# EAGLE design Selectric (EAGLE 7.7.0)

## Sheet 1 of 3
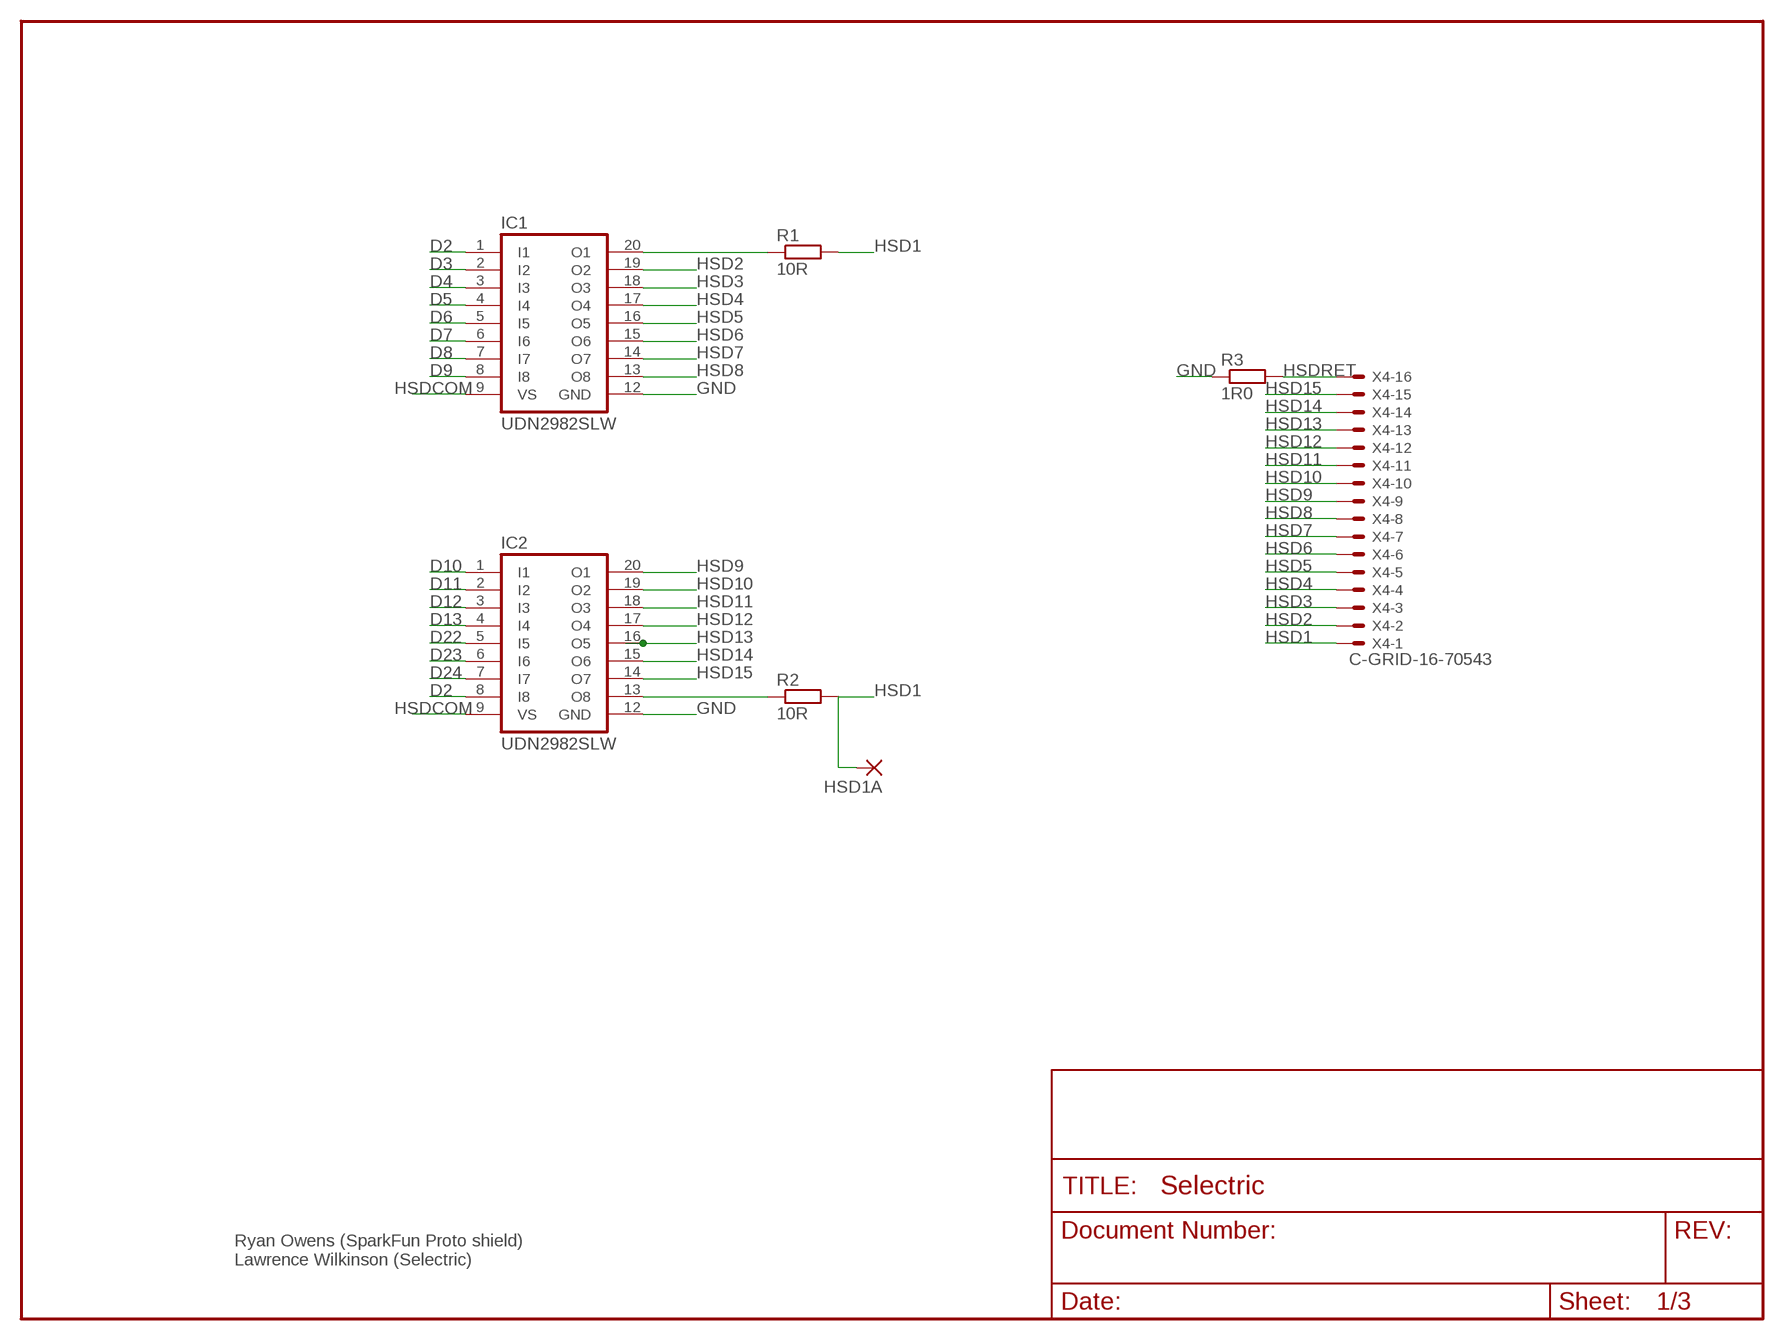
[diagram p0: schematic, sheet 1]

### Parts
HSD1A  2,15/1,0  [2,15/1,0]
IC1  UDN2982SLW  [SO20W]
IC2  UDN2982SLW  [SO20W]
R1  10R  R-EU_M1206  [M1206]
R2  10R  R-EU_M1206  [M1206]
R3  1R0  R-EU_0922/22  [0922/22]
X4  C-GRID-16-70543  [70543-16]

### Nets
D2: IC1.1(I1) IC2.8(I8) ; also sheet 3
D3: IC1.2(I2) ; also sheet 3
D4: IC1.3(I3) ; also sheet 3
D5: IC1.4(I4) ; also sheet 3
D6: IC1.5(I5) ; also sheet 3
D7: IC1.6(I6) ; also sheet 3
D8: IC1.7(I7) ; also sheet 3
D9: IC1.8(I8) ; also sheet 3
D10: IC2.1(I1) ; also sheet 3
D11: IC2.2(I2) ; also sheet 3
D12: IC2.3(I3) ; also sheet 3
D13: IC2.4(I4) ; also sheet 3
D22: IC2.5(I5) ; also sheet 2
D23: IC2.6(I6) ; also sheet 2
D24: IC2.7(I7) ; also sheet 2
GND [supplyIn]: IC1.12(GND) IC2.12(GND) R3.1 ; also sheet 2,3
HSD1 [hsd]: HSD1A.1(P) R1.2 R2.2 X4.1
HSD1A [hsd]: IC2.13(O8) R2.1
HSD2 [hsd]: IC1.19(O2) X4.2
HSD3 [hsd]: IC1.18(O3) X4.3
HSD4 [hsd]: IC1.17(O4) X4.4
HSD5 [hsd]: IC1.16(O5) X4.5
HSD6 [hsd]: IC1.15(O6) X4.6
HSD7 [hsd]: IC1.14(O7) X4.7
HSD8 [hsd]: IC1.13(O8) X4.8
HSD9 [hsd]: IC2.20(O1) X4.9
HSD10 [hsd]: IC2.19(O2) X4.10
HSD11 [hsd]: IC2.18(O3) X4.11
HSD12 [hsd]: IC2.17(O4) X4.12
HSD13 [hsd]: IC2.16(O5) X4.13
HSD14 [hsd]: IC2.15(O6) X4.14
HSD15 [hsd]: IC2.14(O7) X4.15
HSDCOM [supplyIn]: IC1.9(VS) IC2.9(VS) ; also sheet 3
HSDRET [supplyIn]: R3.2 X4.16 ; also sheet 3
N$8 [hsd]: IC1.20(O1) R1.1

### Notes on the sheet
- Ryan Owens (SparkFun Proto shield)
  Lawrence Wilkinson (Selectric)

## Sheet 2 of 3
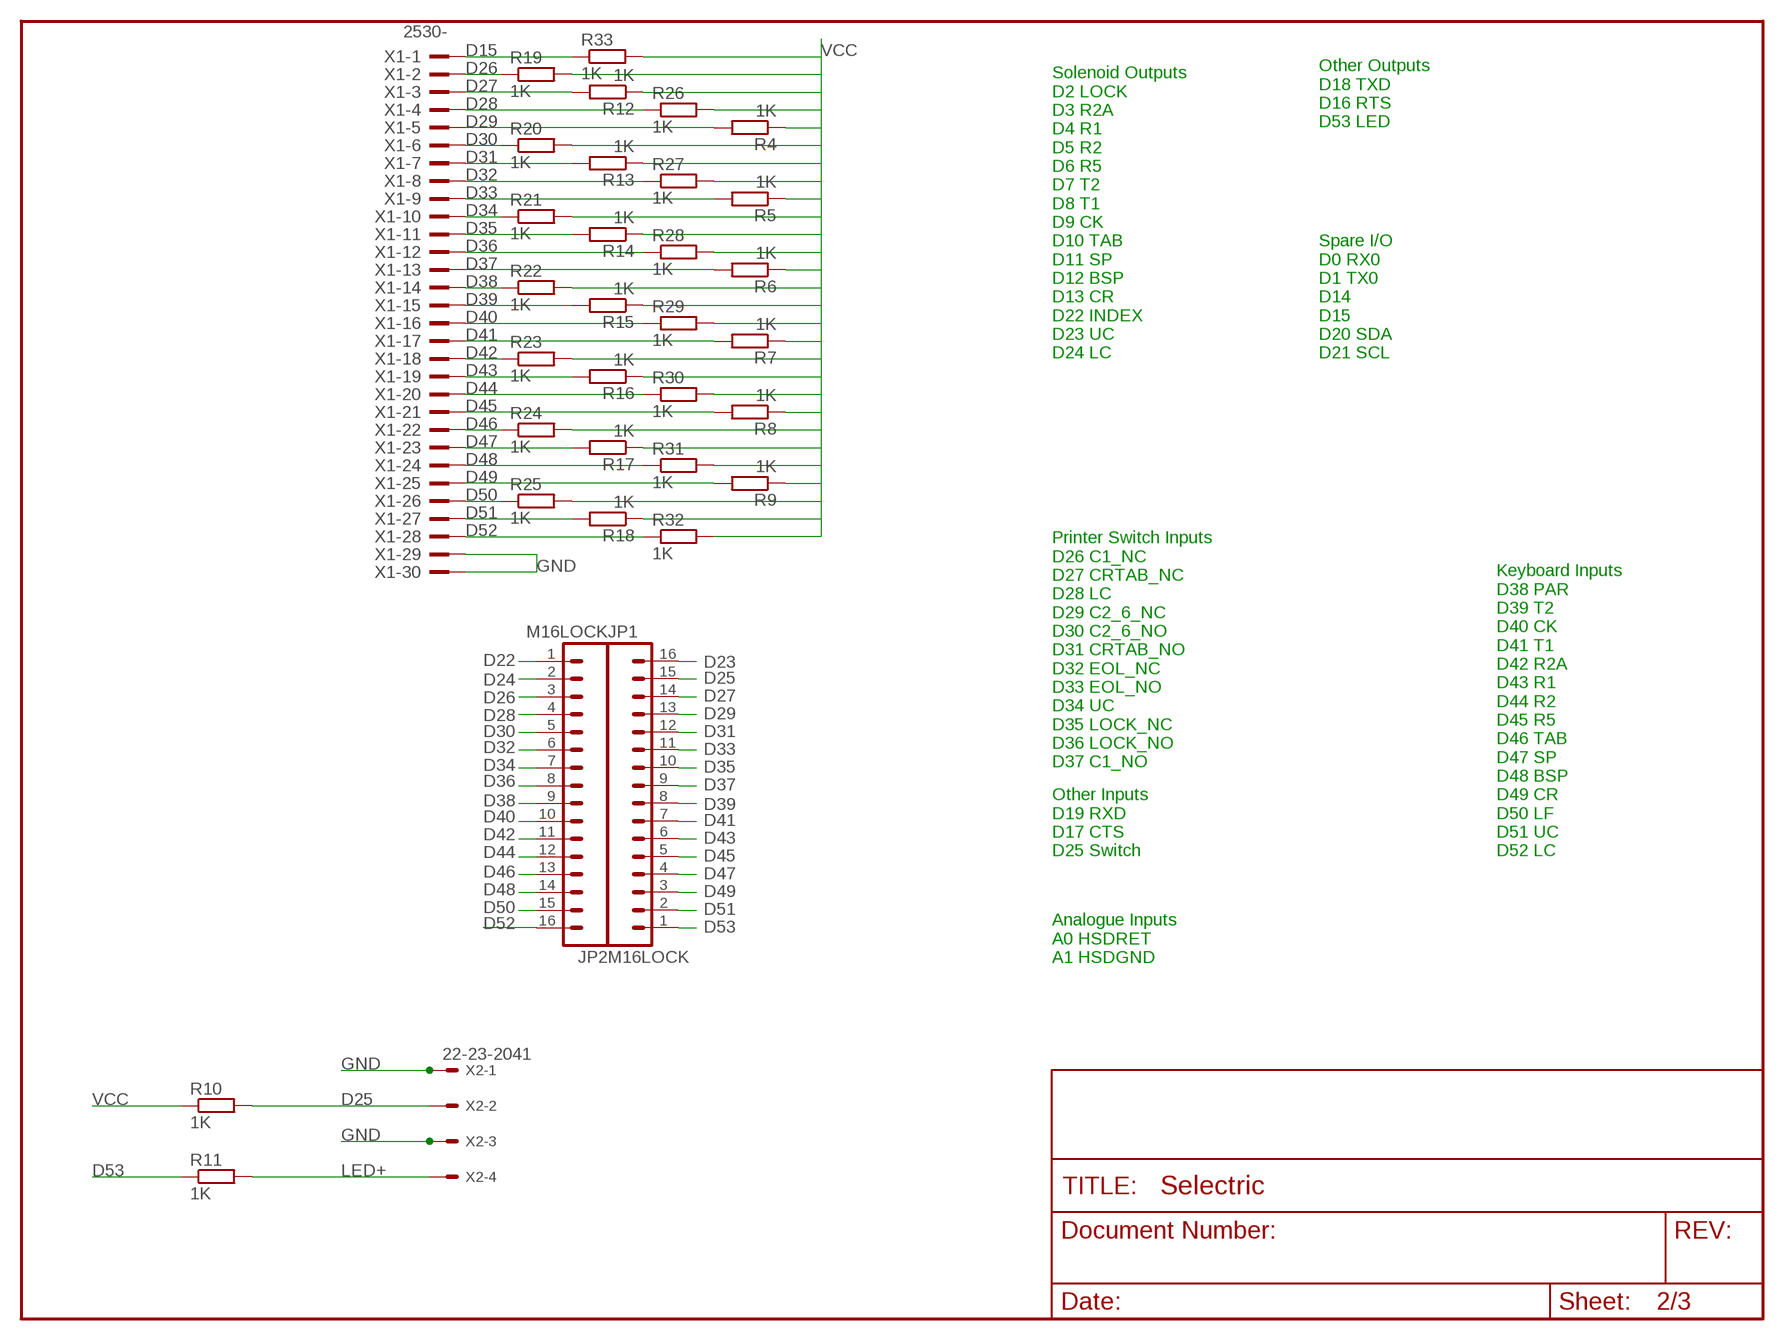
[diagram p1: schematic, sheet 2]

### Parts
JP1  M16LOCK  [1X16_LOCK]
JP2  M16LOCK  [1X16_LOCK]
R4  1K  R-EU_M1206  [M1206]
R5  1K  R-EU_M1206  [M1206]
R6  1K  R-EU_M1206  [M1206]
R7  1K  R-EU_M1206  [M1206]
R8  1K  R-EU_M1206  [M1206]
R9  1K  R-EU_M1206  [M1206]
R10  1K  R-EU_M1206  [M1206]
R11  1K  R-EU_M1206  [M1206]
R12  1K  R-EU_M1206  [M1206]
R13  1K  R-EU_M1206  [M1206]
R14  1K  R-EU_M1206  [M1206]
R15  1K  R-EU_M1206  [M1206]
R16  1K  R-EU_M1206  [M1206]
R17  1K  R-EU_M1206  [M1206]
R18  1K  R-EU_M1206  [M1206]
R19  1K  R-EU_M1206  [M1206]
R20  1K  R-EU_M1206  [M1206]
R21  1K  R-EU_M1206  [M1206]
R22  1K  R-EU_M1206  [M1206]
R23  1K  R-EU_M1206  [M1206]
R24  1K  R-EU_M1206  [M1206]
R25  1K  R-EU_M1206  [M1206]
R26  1K  R-EU_M1206  [M1206]
R27  1K  R-EU_M1206  [M1206]
R28  1K  R-EU_M1206  [M1206]
R29  1K  R-EU_M1206  [M1206]
R30  1K  R-EU_M1206  [M1206]
R31  1K  R-EU_M1206  [M1206]
R32  1K  R-EU_M1206  [M1206]
R33  1K  R-EU_M1206  [M1206]
X1  2530-  [PAK100/2500-30]
X2  22-23-2041  [22-23-2041]

### Nets
D15: R33.1 X1.1 ; also sheet 3
D22: JP2.1 ; also sheet 1
D23: JP1.16 ; also sheet 1
D24: JP2.2 ; also sheet 1
D25: JP1.15 R10.2 X2.2
D26: JP2.3 R19.1 X1.2
D27: JP1.14 R12.2 X1.3
D28: JP2.4 R26.1 X1.4
D29: JP1.13 R4.2 X1.5
D30: JP2.5 R20.1 X1.6
D31: JP1.12 R13.2 X1.7
D32: JP2.6 R27.1 X1.8
D33: JP1.11 R5.2 X1.9
D34: JP2.7 R21.1 X1.10
D35: JP1.10 R14.2 X1.11
D36: JP2.8 R28.1 X1.12
D37: JP1.9 R6.2 X1.13
D38: JP2.9 R22.1 X1.14
D39: JP1.8 R15.2 X1.15
D40: JP2.10 R29.1 X1.16
D41: JP1.7 R7.2 X1.17
D42: JP2.11 R23.1 X1.18
D43: JP1.6 R16.2 X1.19
D44: JP2.12 R30.1 X1.20
D45: JP1.5 R8.2 X1.21
D46: JP2.13 R24.1 X1.22
D47: JP1.4 R17.2 X1.23
D48: JP2.14 R31.1 X1.24
D49: JP1.3 R9.2 X1.25
D50: JP2.15 R25.1 X1.26
D51: JP1.2 R18.2 X1.27
D52: JP2.16 R32.1 X1.28
D53: JP1.1 R11.1
GND [supplyIn]: X1.29 X1.30 X2.1 X2.3 ; also sheet 1,3
LED+: R11.2 X2.4
VCC [supplyIn]: R4.1 R5.1 R6.1 R7.1 R8.1 R9.1 R10.1 R12.1 R13.1 R14.1 R15.1 R16.1 R17.1 R18.1 R19.2 R20.2 R21.2 R22.2 R23.2 R24.2 R25.2 R26.2 R27.2 R28.2 R29.2 R30.2 R31.2 R32.2 R33.2 ; also sheet 3

### Notes on the sheet
- Other Outputs
  D18 TXD
  D16 RTS
  D53 LED
- Solenoid Outputs
  D2 LOCK
  D3 R2A
  D4 R1
  D5 R2
  D6 R5
  D7 T2
  D8 T1
  D9 CK
  D10 TAB
  D11 SP
  D12 BSP
  D13 CR
  D22 INDEX
  D23 UC
  D24 LC
- Spare I/O
  D0 RX0
  D1 TX0
  D14
  D15
  D20 SDA
  D21 SCL
- Printer Switch Inputs
  D26 C1_NC
  D27 CRTAB_NC
  D28 LC
  D29 C2_6_NC
  D30 C2_6_NO
  D31 CRTAB_NO
  D32 EOL_NC
  D33 EOL_NO
  D34 UC
  D35 LOCK_NC
  D36 LOCK_NO
  D37 C1_NO
- Other Inputs
  D19 RXD
  D17 CTS
  D25 Switch
- Keyboard Inputs
  D38 PAR
  D39 T2
  D40 CK
  D41 T1
  D42 R2A
  D43 R1
  D44 R2
  D45 R5
  D46 TAB
  D47 SP
  D48 BSP
  D49 CR
  D50 LF
  D51 UC
  D52 LC
- Analogue Inputs
  A0 HSDRET
  A1 HSDGND

## Sheet 3 of 3
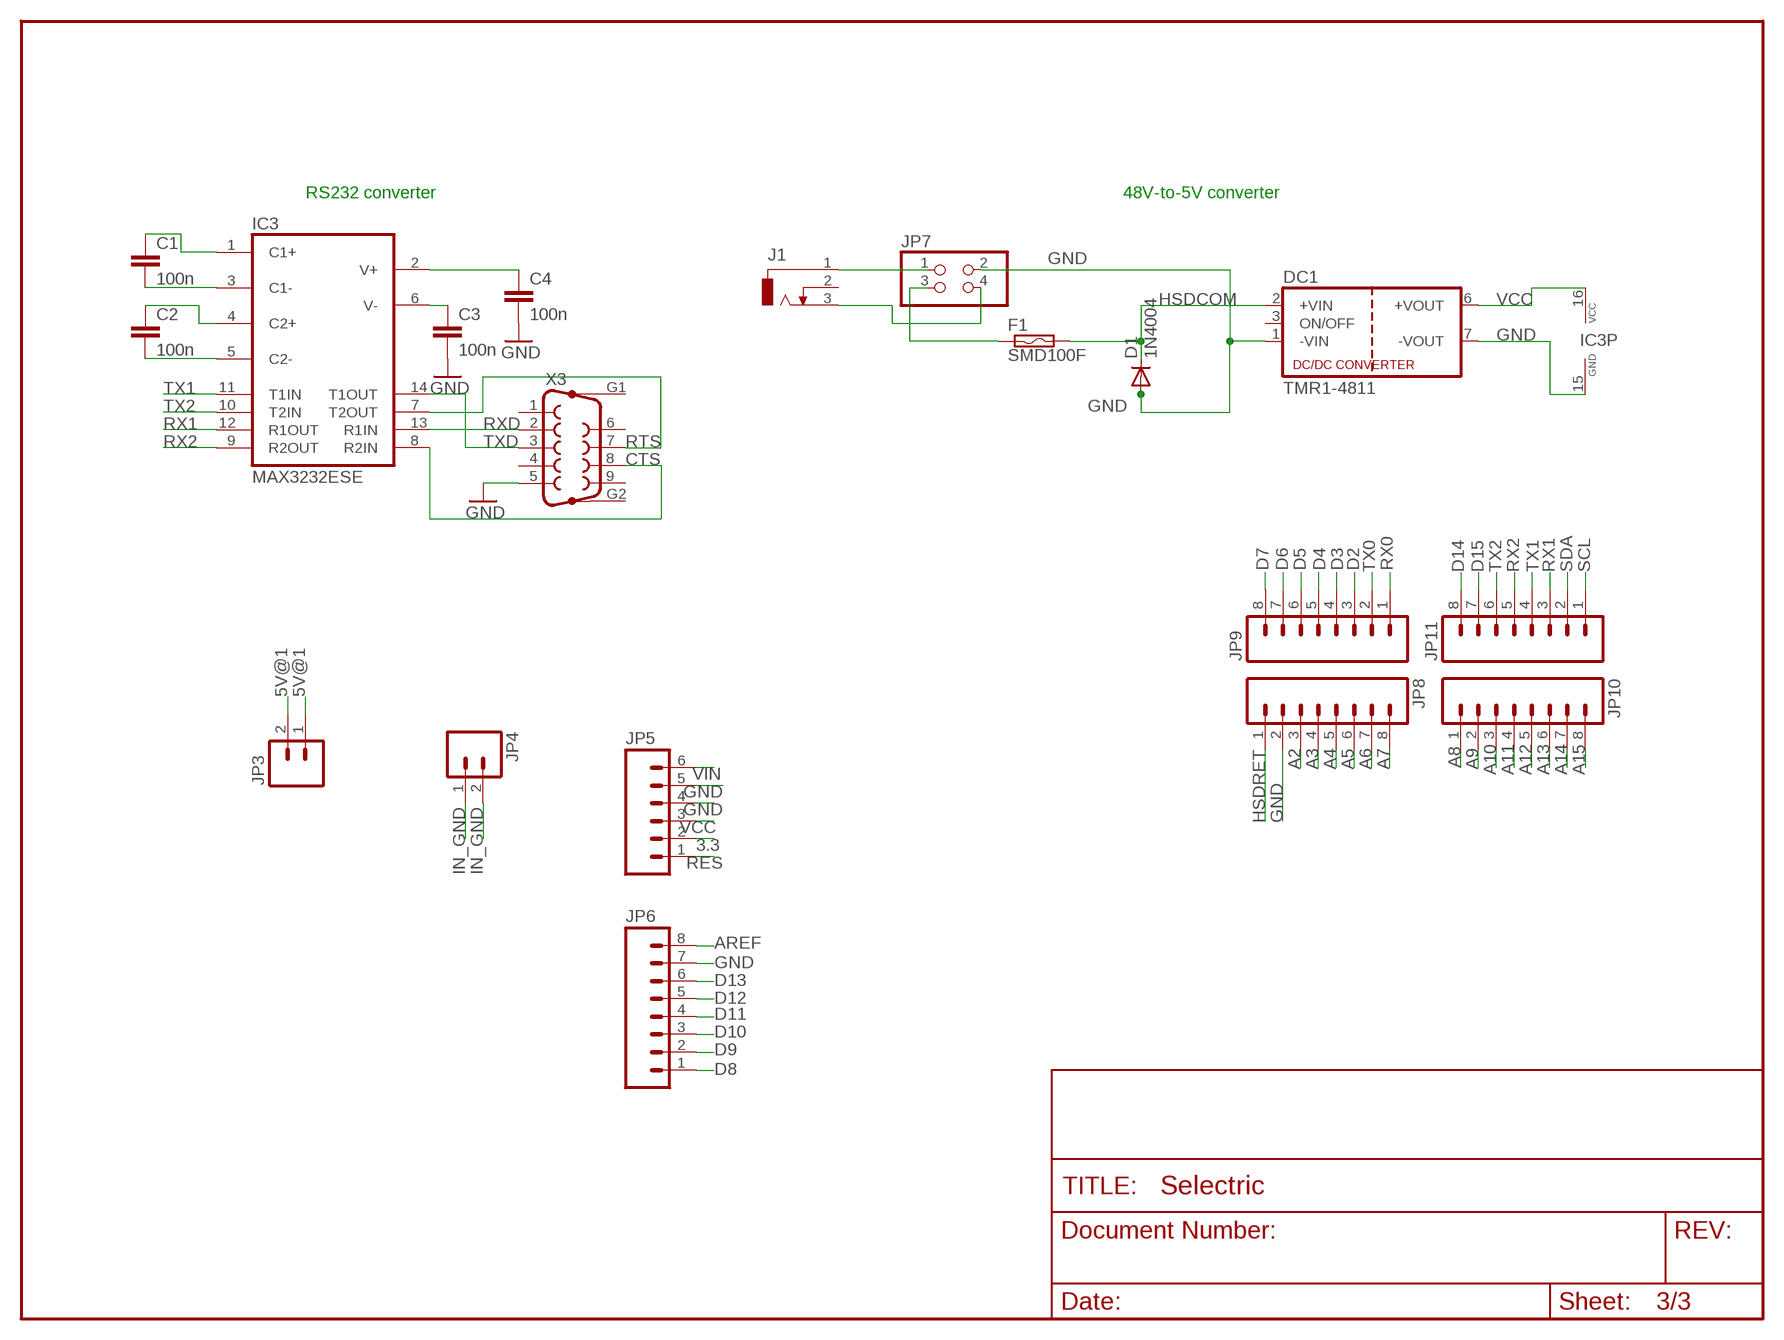
[diagram p2: schematic, sheet 3]

### Parts
C1  100n  C-EUC0603  [C0603]
C2  100n  C-EUC0603  [C0603]
C3  100n  C-EUC0603  [C0603]
C4  100n  C-EUC0603  [C0603]
D1  1N4004  [DO41-10]
DC1  TMR1-4811  [TRACO_SIP-8]
F1  SMD100F  [SMD050F]
IC3  MAX3232ESE  [SO16]
J1  DCJ0303  [DCJ0303]
JP3  M02LOCK  [1X02_LOCK]
JP4  M02LOCK  [1X02_LOCK]
JP5  M06LOCK  [1X06_LOCK]
JP6  M08LOCK  [1X08_LOCK]
JP7  PINHD-2X2  [2X02]
JP8  M08LOCK  [1X08_LOCK]
JP9  M08LOCK  [1X08_LOCK]
JP10  M08LOCK  [1X08_LOCK]
JP11  M08LOCK  [1X08_LOCK]
X3  F09HP  [F09HP]

### Nets
3.3: JP5.2
5V@1: JP3.1 JP3.2
A2: JP8.3
A3: JP8.4
A4: JP8.5
A5: JP8.6
A6: JP8.7
A7: JP8.8
A8: JP10.1
A9: JP10.2
A10: JP10.3
A11: JP10.4
A12: JP10.5
A13: JP10.6
A14: JP10.7
A15: JP10.8
AREF: JP6.8
CTS: IC3.8(R2IN) X3.8
D2: JP9.3 ; also sheet 1
D3: JP9.4 ; also sheet 1
D4: JP9.5 ; also sheet 1
D5: JP9.6 ; also sheet 1
D6: JP9.7 ; also sheet 1
D7: JP9.8 ; also sheet 1
D8: JP6.1 ; also sheet 1
D9: JP6.2 ; also sheet 1
D10: JP6.3 ; also sheet 1
D11: JP6.4 ; also sheet 1
D12: JP6.5 ; also sheet 1
D13: JP6.6 ; also sheet 1
D14: JP11.8
D15: JP11.7 ; also sheet 2
GND [supplyIn]: C3.2 C4.2 D1.A DC1.1(-VIN) DC1.7(-VOUT) IC3.15(GND) JP5.4 JP5.5 JP6.7 JP7.2 JP8.2 X3.5 ; also sheet 1,2
HSDCOM [supplyIn]: D1.C DC1.2(+VIN) F1.2 ; also sheet 1
HSDRET [supplyIn]: JP8.1 ; also sheet 1
IN_GND: JP4.1 JP4.2
N$1: C1.1 IC3.1(C1+)
N$2: C2.1 IC3.4(C2+)
N$3: C1.2 IC3.3(C1-)
N$4: C2.2 IC3.5(C2-)
N$6: C4.1 IC3.2(V+)
N$7: C3.1 IC3.6(V-)
N$23 [supplyIn]: J1.3 JP7.4
N$24 [supplyIn]: J1.1 JP7.1
N$42 [supplyIn]: F1.1 JP7.3
RES: JP5.1
RTS: IC3.7(T2OUT) X3.7
RX0: JP9.1
RX1: IC3.12(R1OUT) JP11.3
RX2: IC3.9(R2OUT) JP11.5
RXD: IC3.13(R1IN) X3.2
SCL: JP11.1
SDA: JP11.2
TX0: JP9.2
TX1: IC3.11(T1IN) JP11.4
TX2: IC3.10(T2IN) JP11.6
TXD: IC3.14(T1OUT) X3.3
VCC [supplyIn]: DC1.6(+VOUT) IC3.16(VCC) JP5.3 ; also sheet 2
VIN: JP5.6
Unconnected: DC1.3(ON/OFF) J1.2 X3.1 X3.4 X3.6 X3.9 X3.G1 X3.G2

### Notes on the sheet
- RS232 converter | 48V-to-5V converter

## Library data of the parts
C1-C4 = rcl:C-EU: CAPACITOR, European symbol
D1 = diode:1N4004: DIODE general purpose rectifier, 1 A
DC1 = traco_tmr:TMR1-4811; MF: TRACO; MPN: TMR1-4811
F1 = switch-raychem:SMD*F: PolySwitch (TM) Resettable Device Source: Data sheet <http://www.farnell.com/datasheets/13482.pdf>; MF: Schurter; MPN: 3404.0009.11
HSD1A = wirepad:2,15/1,0: THROUGH-HOLE PAD
IC1 IC2 = uln-udn:UDN298*: DRIVER ARRAY Source: Allegro Microsystems Inc. / UDN2981-UDN2984.pdf; MF: Allegro; MPN: UDN2982SLW
IC3 = maxim:MAX3232*: True RS-232 Transceivers 3.0V to 5.5V, Low-Power up to 1Mbps, Using Four 0.1µF External Capacitors Source: http://pdfserv.maxim-ic.com/en/ds/MAX3222-MAX3241.pdf; MF: MAXIM; MPN: MAX3232CSE; OC_FARNELL: 9725539; OC_NEWARK: 79C3880
J1 = con-jack:DCJ0303: DC POWER JACK Source: DCJ0303.pdf; OC_FARNELL: unknown; OC_NEWARK: unknown
JP1 JP2 = SparkFun:M16; MF: WURTH; MPN: 61301611121
JP3 JP4 = SparkFun:M02: Header 2 Standard 2-pin 0.1" header. Use with straight break away headers (SKU : PRT-00116), right angle break away headers (PRT-00553), swiss pins (PRT-00743), machine pins (PRT-00117), and female headers (PRT-00115). Molex polarized connector foot print use with SKU : PRT-08233 with associated crimp pins and housings.
JP5 = SparkFun:M06: Header 6 Standard 6-pin 0.1" header. Use with straight break away headers (SKU : PRT-00116), right angle break away headers (PRT-00553), swiss pins (PRT-00743), machine pins (PRT-00117), and female headers (PRT-00115). Molex polarized connector foot print use with SKU : PRT-08094 with associated crimp pins and housings. NOTES ON THE VARIANTS LOCK and LOCK_LONGPADS... This footprint was designed to help hold the alignment of a through-hole component (i.e. 6-pin header) while soldering it into place. You may notice that each hole has been shifted either up or down by 0.005 of an inch from it's more standard position (which is a perfectly straight line). This slight alteration caused the pins (the squares in the middle) to touch the edges of the holes. Because they are alternating, it causes a "brace" to hold the component in place. 0.005 has proven to be the perfect amount of "off-center" position when using our standard breakaway headers. Although looks a little odd when you look at the bare footprint, once you have a header in there, the alteration is very hard to notice. Also, if you push a header all the way into place, it is covered up entirely on the bottom side. This idea of altering the position of holes to aid alignment will be further integrated into the Sparkfun Library for other footprints. It can help hold any component with 3 or more connection pins.; MF: TE CONNECTIVITY; MPN: 826629-6
JP6 JP8-JP11 = SparkFun:M08: Header 8 Standard 8-pin 0.1" header. Use with straight break away headers (SKU : PRT-00116), right angle break away headers (PRT-00553), swiss pins (PRT-00743), machine pins (PRT-00117), and female headers (PRT-00115).; MF: TE CONNECTIVITY; MPN: 826629-8
JP7 = pinhead:PINHD-2X2: PIN HEADER; MF: TE CONNECTIVITY; MPN: 826632-2
R1-R33 = rcl:R-EU_: RESISTOR, European symbol
X1 = con-3m:2530-: 3M (TM) Pak 100 4-Wall Header Source: 3M; MF: 3M; MPN: PAK100/2500-30; OC_FARNELL: 1788688; OC_NEWARK: unknown
X2 = con-molex:22-23-2041: .100" (2.54mm) Center Header - 4 Pin; MF: TE CONNECTIVITY; MPN: 280371-2; OC_FARNELL: 1462920; OC_NEWARK: 38C0355
X3 = con-subd:F09HP: SUB-D; MF: Amphenol; MPN: FCE17-E09PA-490; OC_FARNELL: unknown; OC_NEWARK: unknown
X4 = con-molex:C-GRID-16: CONNECTOR wire to board 2.54 mm (0.100") pitch header; OC_FARNELL: unknown; OC_NEWARK: unknown

## Net classes
0 default: width 0.203 mm, drill 0.254 mm, clearance 0.203 mm
1 supplyIn: width 0.813 mm, drill 0.635 mm, clearance 0.381 mm
2 hsd: width 0.406 mm, drill 0.381 mm, clearance 0.381 mm

## Board
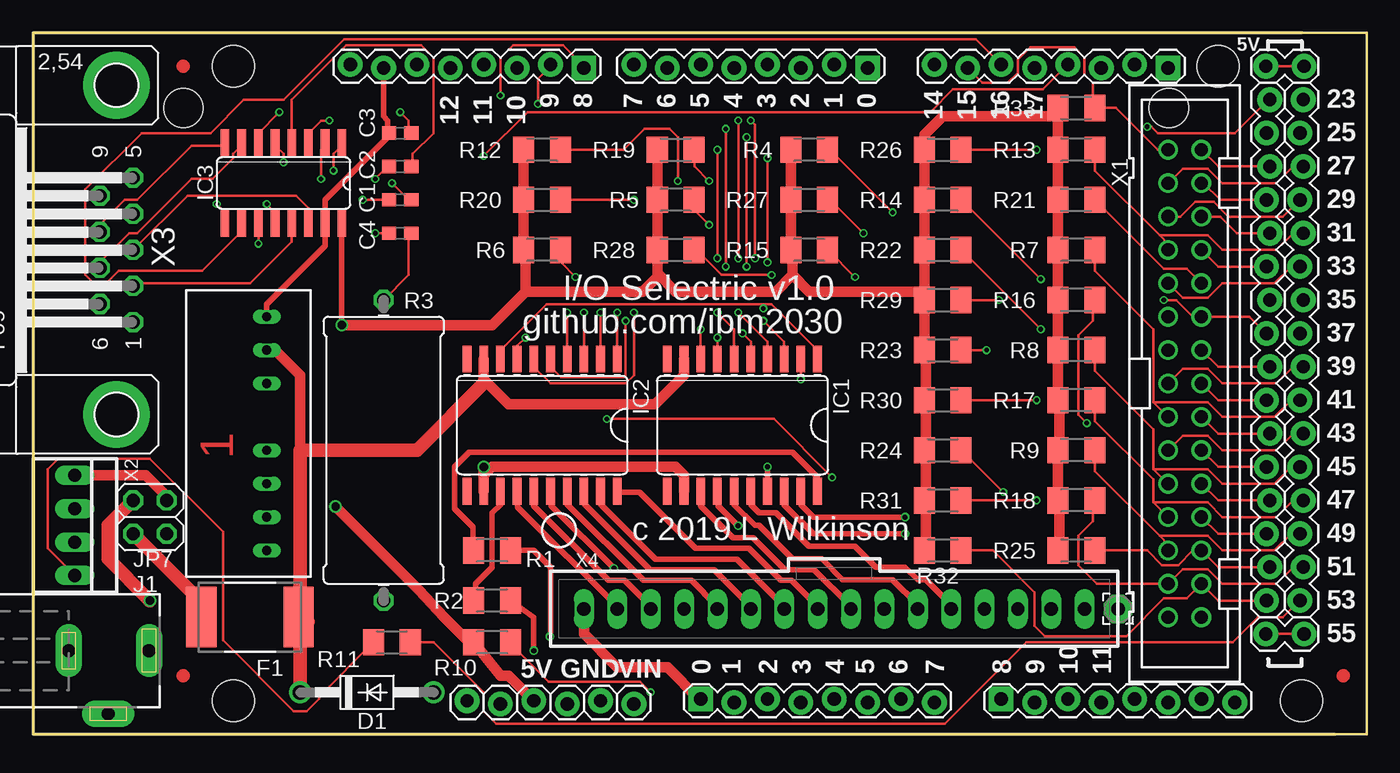
[diagram p3: board, top side]
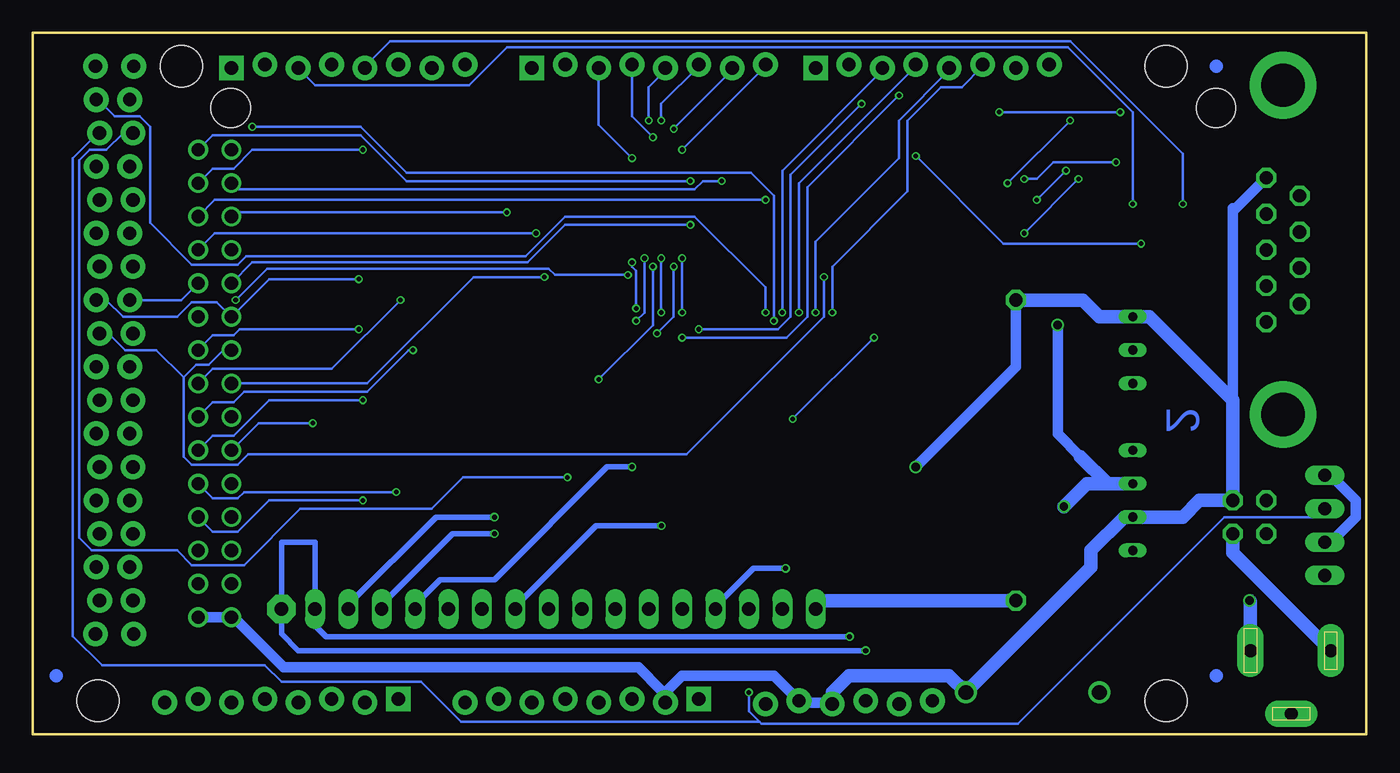
[diagram p4: board, bottom side, seen from below]

Size 101.47 x 53.34 mm. Coordinates in mm from the lower left corner, seen from the top.
Outline: 101.47,53.34 0,53.34 0,0 101.47,0 101.47,53.34
Copper layers (1*16): Top 0.018mm / dielectric 1.55mm / Bottom 0.018mm
Design rules "eC_2Layer_PClass6_BaseCopperO18_eCDefault": minimum track width 0.15mm, minimum drill 0.35mm, track to track 0.15mm, track to pad 0.15mm, pad to pad 0.15mm, via to via 0.15mm, smd to smd 0mil, copper to edge 0.25mm, drill to drill 0.35mm, minimum pad ring 0.175mm, minimum via ring 0.125mm, stop-mask expansion 0mil, vias tented up to drill 0.45mm, thermal gap 0.2mm
Holes 3.2 mm at 15.24,50.8 15.24,2.54 90.17,50.8 96.52,2.54
Holes 3 mm at 11.43,47.62 86.43,47.62
tKeepout: area 12.7,21 to 15.2,24.8
bKeepout: area 12.7,21 to 15.2,24.8
tRestrict: area 14,1.3 to 16.5,3.8; area 14,49.5 to 16.5,52.1; area 88.9,49.5 to 91.4,52.1; area 95.2,1.3 to 97.8,3.8
bRestrict: area 14,1.3 to 16.5,3.8; area 14,49.5 to 16.5,52.1; area 88.9,49.5 to 91.4,52.1; area 95.2,1.3 to 97.8,3.8

### Footprints (pad centres in the part's own frame; a part is rotated, then mirrored left to right if it is on the bottom)
C0603 = smd 1.1 x 1: 1 -0.85,0; 2 0.85,0
DO41-10 = drill 1.118: A 5.08,0; C -5.08,0
TRACO_SIP-8 = drill 0.7 long: 1 -8.89,0; 2 -6.35,0; 3 -3.81,0; 5 1.27,0; 6 3.81,0; 7 6.35,0; 8 8.89,0
SMD050F = smd 2.3 x 4.6: 1 -3.7,0; 2 3.7,0
2,15/1,0 = drill 1.016 pad 2.159 octagon: 1 0,0
SO20W = smd 0.66 x 2.032: 1 -5.715,-5.029; 2 -4.445,-5.029; 3 -3.175,-5.029; 4 -1.905,-5.029; 5 -0.635,-5.029; 6 0.635,-5.029; 7 1.905,-5.029; 8 3.175,-5.029; 9 4.445,-5.029; 10 5.715,-5.029; 11 5.715,5.029; 12 4.445,5.029; 13 3.175,5.029; 14 1.905,5.029; 15 0.635,5.029; 16 -0.635,5.029; 17 -1.905,5.029; 18 -3.175,5.029; 19 -4.445,5.029; 20 -5.715,5.029
SO16 = smd 0.66 x 2.032: 1 -4.445,-3.073; 2 -3.175,-3.073; 3 -1.905,-3.073; 4 -0.635,-3.073; 5 0.635,-3.073; 6 1.905,-3.073; 7 3.175,-3.073; 8 4.445,-3.073; 9 4.445,3.073; 10 3.175,3.073; 11 1.905,3.073; 12 0.635,3.073; 13 -0.635,3.073; 14 -1.905,3.073; 15 -3.175,3.073; 16 -4.445,3.073
DCJ0303 = drill 1 pad 2 long: 1 0,3.1; 2 4.8,0; 3 0,-3
1X16_LOCK = drill 1.016 pad 1.88: 1 0,0.127; 2 2.54,-0.127; 3 5.08,0.127; 4 7.62,-0.127; 5 10.16,0.127; 6 12.7,-0.127; 7 15.24,0.127; 8 17.78,-0.127; 9 20.32,0.127; 10 22.86,-0.127; 11 25.4,0.127; 12 27.94,-0.127; 13 30.48,0.127; 14 33.02,-0.127; 15 35.56,0.127; 16 38.1,-0.127
1X02_LOCK = drill 1.016 pad 1.88: 1 -0.178,0; 2 2.718,0
1X06_LOCK = drill 1.016 pad 1.88: 1 0,0; 2 2.54,-0.254; 3 5.08,0; 4 7.62,-0.254; 5 10.16,0; 6 12.7,-0.254
1X08_LOCK = drill 1.016 pad 1.88 square: 1 0,0.127 | drill 1.016 pad 1.88: 2 2.54,-0.127; 3 5.08,0.127; 4 7.62,-0.127; 5 10.16,0.127; 6 12.7,-0.127; 7 15.24,0.127; 8 17.78,-0.127
2X02 = drill 1.016 octagon: 1 -1.27,-1.27; 2 -1.27,1.27; 3 1.27,-1.27; 4 1.27,1.27
M1206 = smd 1.6 x 2: 1 -1.4,0; 2 1.4,0
0922/22 = drill 1.016 octagon: 1 -11.43,0; 2 11.43,0
PAK100/2500-30 = drill 1 pad 1.422: 1 -17.78,-1.27; 2 -17.78,1.27; 3 -15.24,-1.27; 4 -15.24,1.27; 5 -12.7,-1.27; 6 -12.7,1.27; 7 -10.16,-1.27; 8 -10.16,1.27; 9 -7.62,-1.27; 10 -7.62,1.27; 11 -5.08,-1.27; 12 -5.08,1.27; 13 -2.54,-1.27; 14 -2.54,1.27; 15 0,-1.27; 16 0,1.27; 17 2.54,-1.27; 18 2.54,1.27; 19 5.08,-1.27; 20 5.08,1.27; 21 7.62,-1.27; 22 7.62,1.27; 23 10.16,-1.27; 24 10.16,1.27; 25 12.7,-1.27; 26 12.7,1.27; 27 15.24,-1.27; 28 15.24,1.27; 29 17.78,-1.27; 30 17.78,1.27
22-23-2041 = drill 1 long: 1 -3.81,0; 2 -1.27,0; 3 1.27,0; 4 3.81,0
F09HP = drill 1.016 octagon: 1 -5.486,-1.27; 2 -2.743,-1.27; 3 0,-1.27; 4 2.743,-1.27; 5 5.486,-1.27; 6 -4.115,1.27; 7 -1.372,1.27; 8 1.372,1.27; 9 4.115,1.27 | drill 3.302 pad 5.08: G1 -12.522,0; G2 12.522,0
70543-16 = drill 1.016 long: 1 -19.05,0; 2 -16.51,0; 3 -13.97,0; 4 -11.43,0; 5 -8.89,0; 6 -6.35,0; 7 -3.81,0; 8 -1.27,0; 9 1.27,0; 10 3.81,0; 11 6.35,0; 12 8.89,0; 13 11.43,0; 14 13.97,0; 15 16.51,0; 16 19.05,0

### Placement (x,y rotation side)
C1  27.94,40.64 0 top
C2  27.94,43.18 180 top
C3  27.94,45.72 180 top
C4  27.94,38.1 0 top
D1  25.4,3.17 0 top
DC1  17.78,22.86 270 top
F1  16.51,8.89 0 top
HSD1A  82.55,9.53 0 top
IC1  53.98,23.5 180 top
IC2  38.73,23.5 180 top
IC3  19.05,41.91 180 top
J1  5.71,6.35 270 top
JP1  96.52,10.16 90 top
JP2  93.98,48.26 270 top
JP3  93.98,50.8 0 top
JP4  93.98,7.62 0 top
JP5  33.02,2.54 0 top
JP6  41.91,50.8 180 top
JP7  8.89,16.51 270 top
JP8  50.8,2.54 0 top
JP9  63.5,50.8 180 top
JP10  73.66,2.54 0 top
JP11  86.36,50.8 180 top
R1  34.92,13.97 0 top
R2  34.92,10.16 0 top
R3  26.67,21.59 270 top
R4  59.05,44.45 0 top
R5  48.9,40.64 0 top
R6  38.73,36.83 0 top
R7  79.38,36.83 0 top
R8  79.38,29.21 0 top
R9  79.38,21.59 0 top
R10  34.92,6.99 0 top
R11  27.3,6.99 180 top
R12  38.73,44.45 0 top
R13  79.38,44.45 0 top
R14  69.22,40.64 0 top
R15  59.05,36.83 0 top
R16  79.38,33.02 0 top
R17  79.38,25.4 0 top
R18  79.38,17.78 0 top
R19  48.9,44.45 180 top
R20  38.73,40.64 180 top
R21  79.38,40.64 180 top
R22  69.22,36.83 180 top
R23  69.22,29.21 180 top
R24  69.22,21.59 180 top
R25  79.38,13.97 180 top
R26  69.22,44.45 180 top
R27  59.05,40.64 180 top
R28  48.9,36.83 180 top
R29  69.22,33.02 180 top
R30  69.22,25.4 180 top
R31  69.22,17.78 180 top
R32  69.22,13.97 180 top
R33  79.38,47.62 180 top
U$1  [CIRCLE-1MM-3R]  11.43,4.45 0 top
U$2  [CIRCLE-1MM-3R]  99.69,4.45 0 top
U$3  [CIRCLE-1MM-3R]  11.43,50.8 0 top
X1  87.63,26.67 270 top
X2  3.17,15.88 270 top
X3  6.35,36.83 90 top
X4  60.96,9.53 180 top

### Tracks (layer width: path | path; a pad name or v marks a point on that pad's centre or on a via)
5V@1
  Top 0.203: JP3.2 JP3.1
CTS
  Top 0.203: X3.8 5.08,38.73 6.99,40.64 7.94,40.64 12.06,44.77 14.61,44.77 IC3.8
D2  (via drill 0.35)
  Top 0.203: IC2.8 35.56,29.21 39.05,32.7 55.56,32.7 | 55.56,32.7 56.2,32.7 59.69,29.21 IC1.1 | v55.88,35.88 v55.88,43.81 | 55.56,32.7 v55.56,32.38
  Bottom 0.203: JP9.3 58.42,46.35 v55.88,43.81 | v55.88,35.88 55.88,35.56 55.56,35.24 v55.56,32.38
D3  (via drill 0.35)
  Top 0.203: v58.42,26.99 IC1.2 | v54.29,45.4 v54.29,35.56
  Bottom 0.203: v58.42,26.99 54.29,31.11 v54.29,35.56 | v54.29,45.4 55.88,46.99 JP9.4
D4  (via drill 0.35)
  Top 0.203: IC1.3 57.15,29.84 v55.56,31.43 | v54.93,36.2 54.93,46.35 v54.61,46.67
  Bottom 0.203: v55.56,31.43 54.93,32.07 v54.93,36.2 | v54.61,46.67 54.61,49.21 53.34,50.48 JP9.5
D5  (via drill 0.35)
  Top 0.203: IC1.4 55.88,29.84 v53.66,32.07 | v53.66,46.67 v53.66,36.2
  Bottom 0.203: v53.66,36.2 v53.66,32.07 | v53.66,46.67 53.66,47.94 50.8,50.8 JP9.6
D6  (via drill 0.35)
  Top 0.203: IC1.5 54.61,29.84 v53.98,30.48 | v52.7,46.04 v52.7,35.56
  Bottom 0.203: v53.98,30.48 52.7,31.75 v52.7,35.56 | v52.7,46.04 48.26,50.48 JP9.7
D7  (via drill 0.35)
  Top 0.203: IC1.6 53.34,30.8 v52.07,32.07 | v52.07,44.45 v52.07,36.2
  Bottom 0.203: v52.07,36.2 v52.07,32.07 | v52.07,44.45 45.72,50.8 JP9.8
D8  (via drill 0.35)
  Top 0.203: v52.07,30.16 IC1.7 | v35.56,48.58 35.56,51.44 36.51,52.39 40.32,52.39 41.91,50.8 JP6.1
  Bottom 0.203: v52.07,30.16 44.13,30.16 42.55,31.75 42.55,41.59 v35.56,48.58
D9  (via drill 0.35)
  Top 0.203: v50.8,30.8 IC1.8 | v38.42,47.94 38.42,49.85 39.37,50.8 JP6.2
  Bottom 0.203: v50.8,30.8 44.77,30.8 43.81,31.75 43.81,42.55 v38.42,47.94
D10  (via drill 0.35)
  Top 0.203: v44.45,32.07 IC2.1
  Bottom 0.203: v44.45,32.07 44.45,42.86 36.83,50.48 JP6.3
D11  (via drill 0.35)
  Top 0.203: v43.18,32.07 IC2.2
  Bottom 0.203: v43.18,32.07 43.18,41.91 34.29,50.8 JP6.4
D12  (via drill 0.35)
  Top 0.203: v41.91,32.07 IC2.3
  Bottom 0.203: v41.91,32.07 41.91,37.47 35.56,43.81 35.56,46.67 31.75,50.48 JP6.5
D13  (via drill 0.35)
  Top 0.203: v40.64,32.07 IC2.4
  Bottom 0.203: v40.64,32.07 40.64,35.56 34.92,41.27 34.92,46.67 32.38,49.21 30.8,49.21 29.21,50.8 JP6.6
D15
  Top 0.203: X1.1 85.57,44.45 82.39,47.62 80.8,47.62 R33.1 80.64,47.62 80.64,49.53 80.01,50.16 80.01,51.44 79.22,52.23 75.88,52.23 74.93,51.28 74.93,50.32 74.14,49.53 72.23,49.53 71.12,50.64 JP11.7
D22  (via drill 0.35)
  Top 0.203: IC2.5 39.37,27.94 40.16,27.15 44.93,27.15 45.09,27.3 v45.09,31.43 | v84.77,46.2 85.09,46.2 85.57,45.72 91.44,45.72 93.98,48.26 JP2.1
  Bottom 0.203: v45.09,31.43 45.09,40.96 46.83,42.7 73.03,42.7 76.52,46.2 v84.77,46.2
D23  (via drill 0.35)
  Top 0.203: IC2.6 38.1,27.94 39.37,26.67 45.09,26.67 45.72,27.3 v45.72,32.07
  Bottom 0.203: v45.72,32.07 45.72,33.97 51.12,39.37 60.96,39.37 63.98,36.35 85.25,36.35 85.88,35.72 89.38,35.72 92.55,38.89 92.55,46.2 93.34,46.99 95.25,46.99 96.52,48.26 JP1.16
D24  (via drill 0.35)
  Top 0.203: IC2.7 36.83,29.53 v37.47,30.16 | v60.8,19.53 56.36,23.97 v43.66,23.97
  Bottom 0.203: JP2.2 94.61,45.72 95.89,44.45 97.16,44.45 97.95,43.66 97.95,14.92 97,13.97 90.49,13.97 89.38,12.86 85.41,12.86 81.12,17.14 71.12,17.14 68.74,19.53 v60.8,19.53 | v37.47,30.16 v43.66,23.97
D25  (via drill 0.35)
  Top 0.203: 36.33,6.86 R10.2 36.35,6.83 39.21,3.97 46.2,3.97 v46.99,3.17
  Bottom 0.203: v46.99,3.17 46.99,1.75 46.2,0.95 | 46.2,0.95 46.04,0.79 26.51,0.79 10.79,16.51 3.81,16.51 X2.2 | 46.2,0.95 68.9,0.95 71.91,3.97 82.55,3.97 83.82,5.24 96.2,5.24 98.42,7.46 98.42,43.81 96.52,45.72 JP1.15
D26  (via drill 0.35)
  Top 0.203: v51.44,42.07 50.32,43.18 50.32,44.45 R19.1 | JP2.3 90.17,43.18 X1.2
  Bottom 0.203: v51.44,42.07 73.03,42.07 76.52,45.56 87.79,45.56 X1.2
D27  (via drill 0.35)
  Top 0.203: R12.2 44.93,44.45 46.51,46.04 48.42,46.04 49.05,45.4 v49.05,42.07 | JP1.14 95.89,43.18 94.61,41.91 90.49,41.91 89.38,43.02 87.47,43.02 X1.3
  Bottom 0.203: v49.05,42.07 50.48,42.07 51.12,41.43 85.88,41.43 X1.3
D28  (via drill 0.35)
  Top 0.203: v76.36,44.45 R26.1 | JP2.4 90.33,40.64 89.06,41.91 X1.4
  Bottom 0.203: v76.36,44.45 84.77,44.45 86.2,43.02 87.79,43.02 X1.4
D29  (via drill 0.35)
  Top 0.203: v65.41,39.69 60.64,44.45 R4.2 | X1.5 87.31,39.37 88.42,40.48 89.85,40.48 90.96,39.37 95.09,39.37 96.36,40.64 JP1.13
  Bottom 0.203: v65.41,39.69 86.04,39.69 X1.5
D30  (via drill 0.35)
  Top 0.203: v45.72,40.64 R20.1 | X1.6 90.33,39.37 91.6,38.1 JP2.5
  Bottom 0.203: v45.72,40.64 87.63,40.64 X1.6
D31
  Top 0.203: 85.72,37.94 86.36,37.31 X1.7 | 85.72,37.94 80.8,42.86 80.8,44.45 R13.2 | JP1.12 95.89,38.1 94.61,36.83 90.49,36.83 89.38,37.94 85.72,37.94
D32  (via drill 0.35)
  Top 0.203: v63.18,38.1 60.64,40.64 R27.1 | JP2.6 90.17,35.56 X1.8
  Bottom 0.203: v63.18,38.1 87.63,38.1 X1.8
D33  (via drill 0.35)
  Top 0.203: v51.44,38.73 50.32,39.85 50.32,40.64 R5.2 | JP1.11 95.73,35.56 94.46,34.29 90.49,34.29 89.38,33.18 87.47,33.18 X1.9
  Bottom 0.203: v51.44,38.73 60.96,38.73 63.82,35.88 84.77,35.88 X1.9
D34
  Top 0.203: X1.10 87.79,35.4 86.04,35.4 80.8,40.64 R21.1
  Bottom 0.203: JP2.7 90.17,33.02 X1.10
D35  (via drill 0.35)
  Top 0.203: v76.68,34.61 70.64,40.64 R14.2
  Bottom 0.203: v76.68,34.61 83.5,34.61 X1.11 87.47,32.86 89.38,32.86 90.49,31.75 94.61,31.75 95.89,33.02 JP1.10
D36  (via drill 0.35)
  Top 0.203: v56.2,34.92 52.39,34.92 50.48,36.83 R28.1 | JP2.8 93.82,30.48 92.55,31.75 X1.12 88.27,31.75 87,33.02 v86.04,33.02
  Bottom 0.203: v56.2,34.92 61.75,34.92 62.23,35.4 83.66,35.4 v86.04,33.02
D37  (via drill 0.35)
  Top 0.203: v41.27,34.77 40.16,35.88 40.16,36.83 R6.2
  Bottom 0.203: v41.27,34.77 41.27,31.75 51.75,21.27 85.09,21.27 85.88,20.48 89.38,20.48 90.01,21.11 90.01,27.15 | 90.01,27.15 89.06,28.1 88.11,28.1 87,29.21 X1.13 | JP1.9 95.73,30.48 94.46,29.21 92.08,29.21 90.01,27.15
D38  (via drill 0.35)
  Top 0.203: v76.68,30.8 70.64,36.83 R22.1 | JP2.9 90.17,27.94 X1.14
  Bottom 0.203: v76.68,30.8 85.72,30.8 86.2,30.32 87.79,30.32 X1.14
D39  (via drill 0.35)
  Top 0.203: v62.55,34.77 60.48,36.83 R15.2 | JP1.8 95.89,27.94 94.61,26.67 90.49,26.67 89.38,27.78 87.47,27.78 X1.15
  Bottom 0.203: v62.55,34.77 67.94,34.77 76.04,26.67 X1.15
D40  (via drill 0.35)
  Top 0.203: v73.5,33.02 R29.1 | JP2.10 90.17,25.4 X1.16
  Bottom 0.203: v73.5,33.02 78.74,27.78 87.79,27.78 X1.16
D41
  Top 0.203: 85.25,25.24 85.25,30.8 80.8,35.24 80.8,36.83 R7.2 | X1.17 85.25,25.24 | JP1.7 95.73,25.4 94.46,24.13 90.49,24.13 89.38,25.24 85.25,25.24
D42  (via drill 0.35)
  Top 0.203: v72.55,29.21 R23.1 | JP2.11 90.17,22.86 X1.18
  Bottom 0.203: v72.55,29.21 72.87,29.21 76.04,26.04 85.41,26.04 86.2,25.24 87.79,25.24 X1.18
D43  (via drill 0.35)
  Top 0.203: v80.17,23.65 79.53,24.29 79.53,30.32 80.64,31.43 80.64,33.02 R16.2 | JP1.6 95.89,22.86 94.61,21.59 90.49,21.59 89.38,22.7 87.47,22.7 X1.19
  Bottom 0.203: v80.17,23.65 84.3,23.65 X1.19
D44  (via drill 0.35)
  Top 0.203: v76.36,25.4 R30.1 | JP2.12 90.17,20.32 X1.20
  Bottom 0.203: v76.36,25.4 83.5,25.4 86.2,22.7 87.79,22.7 X1.20
D45
  Top 0.203: 85.25,20.16 85.25,23.18 80.8,27.62 80.8,29.21 R8.2 | X1.21 85.25,20.16 | JP1.5 95.73,20.32 94.46,19.05 90.49,19.05 89.38,20.16 85.25,20.16
D46  (via drill 0.35)
  Top 0.203: v73.82,18.41 70.64,21.59 R24.1 | JP2.13 90.17,17.78 X1.22
  Bottom 0.203: v73.82,18.41 85.41,18.41 85.88,17.94 87.79,17.94 X1.22
D47
  Top 0.203: 85.25,17.62 85.25,19.37 80.8,23.81 80.8,25.4 R17.2 | X1.23 85.25,17.62 | JP1.4 95.89,17.78 94.61,16.51 90.49,16.51 89.38,17.62 85.25,17.62
D48  (via drill 0.35)
  Top 0.203: v76.36,17.78 R31.1 | JP2.14 90.17,15.24 X1.24
  Bottom 0.203: v76.36,17.78 83.5,17.78 85.88,15.4 87.79,15.4 X1.24
D49
  Top 0.203: 85.72,15.08 86.36,14.45 X1.25 | 85.72,15.08 80.8,20 80.8,21.59 R9.2 | JP1.3 95.73,15.24 94.46,13.97 90.49,13.97 89.38,15.08 85.72,15.08
D50
  Top 0.203: 80.64,13.97 R25.1 84.77,13.97 85.88,12.86 87.15,12.86 88.27,13.97 X1.26 90.17,12.7 JP2.15
D51
  Top 0.203: 80.96,17.78 R18.2 80.64,17.78 80.64,16.19 79.53,15.08 79.53,12.86 80.96,11.43 X1.27 87.47,12.54 89.38,12.54 90.49,11.43 94.61,11.43 95.89,12.7 JP1.2
D52
  Top 0.203: R32.1 73.03,13.97 76.2,10.79 76.2,8.26 76.99,7.46 83.19,7.46 86.04,10.32 87.79,10.32 X1.28 90.17,10.16 JP2.16
D53
  Top 0.203: 96.52,10.16 JP1.1 96.36,10.16 95.09,8.89 93.19,8.89 91.28,6.99 75.56,6.99 69.37,0.79 35.24,0.79 34.29,1.75 34.29,3.17 30.48,6.99 R11.1
GND  (via drill 0.64)
  Top 0.203: C4.2 28.57,37.88 28.57,34.92 R3.1
  Top 0.406: 26.99,45.72 26.99,46.67 26.67,46.99 JP6.7 | C3.2 26.99,45.4 22.23,40.64 IC3.15 22.23,37.15 17.78,32.7 DC1.1
  Top 0.813: 34.29,19.68 IC2.12 | 34.29,19.68 34.92,20.32 48.9,20.32 49.53,19.68 IC1.12 | 26.99,45.72 C3.2 | X2.1 8.57,19.68 10.32,17.94 JP7.2 | 34.29,19.68 v34.29,20.32
  Bottom 0.813: JP5.4 40.64,2.38 43.02,2.38 JP5.5 45.09,4.45 52.07,4.45 53.34,3.17 JP8.2 53.66,3.33 55.4,5.08 82.39,5.08 86.2,8.89 X1.29 X1.30 | 7.62,42.23 X3.5 9.93,40.01 10.16,40.01 10.16,25.4 | X2.3 2.7,14.61 0.79,16.51 0.79,17.78 2.7,19.68 X2.1 | v34.29,20.32 26.67,27.94 R3.1
  Bottom 1.016: 40.64,2.38 40.64,3.17 39.37,4.45 31.75,4.45 D1.A 20.95,12.7 20.95,13.97 18.41,16.51 DC1.7 13.97,16.51 12.7,17.78 JP7.2 10.16,25.4 16.51,31.75 DC1.1 20.32,31.75 21.59,33.02 R3.1
HSD1  (via drill 0.38)
  Top 0.406: 36.35,10.16 R2.2 38.1,8.89 v38.1,6.35 | 36.35,13.97 R1.2 38.1,13.97 39.37,12.7 39.37,7.42 v39.32,7.42
  Bottom 0.406: v39.32,7.42 79.17,7.42 80.01,8.26 X4.1 80.01,14.61 82.55,14.61 HSD1A.1 | v38.1,6.35 81.28,6.35 82.55,7.62 HSD1A.1 | 82.55,8.89 HSD1A.1
HSD1A
  Top 0.406: IC2.13 35.56,17.46 34.92,16.83 34.92,12.7 33.66,11.43 33.66,10.16 R2.1
HSD2  (via drill 0.38)
  Top 0.406: IC1.19 58.42,17.46 59.37,16.51 v66.36,16.51
  Bottom 0.406: v66.36,16.51 70.8,16.51 77.47,9.84 X4.2
HSD3  (via drill 0.38)
  Top 0.406: IC1.18 57.15,17.46 59.37,15.24 v66.36,15.24
  Bottom 0.406: v66.36,15.24 69.53,15.24 74.93,9.84 X4.3
HSD4  (via drill 0.38)
  Top 0.406: v55.88,20.32 IC1.17
  Bottom 0.406: v55.88,20.32 57.78,20.32 66.36,11.75 70.48,11.75 72.39,9.84 X4.4
HSD5
  Top 0.406: IC1.16 54.61,17.46 55.24,16.83 56.52,16.83 59.05,14.29 62.55,14.29 64.14,12.7 66.36,12.7 67.31,11.75 67.94,11.75 69.85,9.84 X4.5
HSD6
  Top 0.406: IC1.15 53.34,17.46 54.93,15.88 55.24,15.88 57.78,13.34 60.01,13.34 61.59,11.75 65.41,11.75 67.31,9.84 X4.6
HSD7  (via drill 0.38)
  Top 0.406: v53.65,15.85 52.12,17.37 52.12,18.39 IC1.14
  Bottom 0.406: v53.65,15.85 58.62,15.85 64.72,9.75 64.72,9.55 X4.7
HSD8
  Top 0.406: IC1.13 50.8,17.37 53.24,14.94 54.76,14.94 57.2,12.5 59.44,12.5 62.18,9.75 62.18,9.55 X4.8
HSD9
  Top 0.406: IC2.20 44.5,18.39 46.13,18.39 50.39,14.12 54.46,14.12 56.9,11.68 57.71,11.68 59.64,9.75 59.64,9.55 X4.9
HSD10
  Top 0.406: IC2.19 43.18,17.48 47.35,13.31 53.54,13.31 57.1,9.75 57.1,9.55 X4.10
HSD11
  Top 0.406: IC2.18 41.96,18.39 41.96,17.48 46.94,12.5 51.82,12.5 54.56,9.75 54.56,9.55 X4.11
HSD12
  Top 0.406: IC2.17 40.64,17.48 46.43,11.68 50.09,11.68 52.02,9.75 52.02,9.55 X4.12
HSD13  (via drill 0.38)
  Top 0.406: v44.2,12.6 39.42,17.37 39.42,18.39 IC2.16
  Bottom 0.406: v44.2,12.6 46.63,12.6 49.48,9.75 49.48,9.55 X4.13
HSD14
  Top 0.406: IC2.15 38.1,17.37 43.79,11.68 45.01,11.68 46.94,9.75 46.94,9.55 X4.14
HSD15
  Top 0.406: IC2.14 36.88,18.39 36.88,17.27 44.4,9.75 44.4,9.55 X4.15
HSDCOM
  Top 0.813: F1.2 20.32,8.89 20.32,8.26 F1.2 | 20.69,8.46 F1.2 | 21.03,8.53 F1.2 | 20.32,21.59 20.32,27.3 18.41,29.21 17.72,29.15 17.83,29.15 DC1.2 | 20.32,9 F1.2 | 34.29,26.67 34.29,26.99 | 34.29,26.99 IC2.9 | IC1.9 49.53,27.3 47.31,25.08 36.2,25.08 34.29,26.99
  Top 1.016: 20.32,8.26 D1.C | 20.32,9 20.32,21.59 29.21,21.59 34.29,26.67
HSDRET
  Top 0.813: JP8.1 50.67,2.67 48.26,5.08 44.45,5.08 41.91,7.62 X4.16
  Bottom 0.813: 41.27,10.16 X4.16
  Bottom 1.016: 41.27,10.16 R3.2
IN_GND
  Top 0.203: JP4.2 JP4.1
LED+
  Top 0.203: X2.4 1.11,14.13 1.11,20.16 1.91,20.95 8.89,20.95 14.45,15.4 14.45,7.14 19.84,1.75 20.8,1.75 21.75,2.7 21.75,2.86 25.88,6.99 R11.2
N$1  (via drill 0.35)
  Top 0.203: v25.08,40.64 C1.1 | v22.86,42.86 22.86,44.13 23.5,44.77 IC3.1
  Bottom 0.203: v22.86,42.86 v25.08,40.64
N$2
  Top 0.203: IC3.4 19.68,48.26 23.81,52.39 29.53,52.39 30.48,51.44 30.48,45.72 28.89,44.13 28.89,43.18 C2.1
N$3  (via drill 0.35)
  Top 0.203: v27.3,41.91 28.57,40.64 C1.2 | v22.54,46.67 21.91,46.67 20.95,45.72 IC3.3
  Bottom 0.203: v22.54,46.67 v27.3,41.91
N$4  (via drill 0.35)
  Top 0.203: v26.04,42.23 26.99,43.18 C2.2 | v19.05,43.5 19.05,44.13 18.41,44.77 IC3.5
  Bottom 0.203: v26.04,42.23 25.08,42.23 23.81,43.5 v19.05,43.5
N$6  (via drill 0.35)
  Top 0.203: v26.04,38.1 C4.1 | v21.91,42.23 21.91,44.45 22.23,44.77 IC3.2
  Bottom 0.203: v21.91,42.23 v26.04,38.1
N$7  (via drill 0.35)
  Top 0.203: v27.94,47.31 28.57,46.67 28.57,45.72 C3.1 | v18.73,47.31 17.14,45.72 IC3.6
  Bottom 0.203: v18.73,47.31 v27.94,47.31
N$8
  Top 0.406: IC1.20 59.69,19.53 57.78,21.43 33.18,21.43 32.07,20.32 32.07,17.14 33.5,15.72 33.5,13.97 R1.1
N$23
  Bottom 1.016: JP7.4 10.16,13.79 J1.3
N$24  (via drill 0.64)
  Top 1.016: v8.89,10.16 5.71,13.34 5.71,15.88 JP7.1
  Bottom 1.016: v8.89,10.16 8.81,10.09 J1.1
N$42
  Top 1.016: JP7.3 12.7,10.16 12.7,9 F1.1
RTS
  Top 0.203: X3.7 5.08,35.88 7.3,38.1 7.94,38.1 12.06,42.23 13.65,42.23 15.24,43.81 15.24,44.13 15.88,44.77 IC3.7
RX1  (via drill 0.35)
  Top 0.203: IC3.12 18.41,39.69 v17.78,40.32
  Bottom 0.203: v17.78,40.32 17.78,47.31 22.7,52.23 65.41,52.23 68.26,49.37 80.01,49.37 81.28,50.64 JP11.3
RX2  (via drill 0.35)
  Top 0.203: 14.61,38.73 IC3.9 14.61,39.69 v13.97,40.32
  Bottom 0.203: v13.97,40.32 13.97,44.13 22.54,52.7 74.3,52.7 76.2,50.8 JP11.5
RXD
  Top 0.203: IC3.13 19.68,37.47 16.51,34.29 7.62,34.29 X3.2
TX1  (via drill 0.35)
  Top 0.203: v17.14,37.31 IC3.11 | v34.29,43.97 37.62,47.31 68.26,47.31 70.01,49.05 76.83,49.05 78.74,50.96 JP11.4
  Bottom 0.203: v17.14,37.31 27.62,37.31 v34.29,43.97
TX2
  Top 0.203: IC3.10 15.88,38.26 12.86,35.24 6.51,35.24 5.56,34.29 4.6,34.29 3.97,34.92 3.97,41.43 8.26,45.72 13.49,45.72 16.03,48.26 19.05,48.26 23.65,52.86 71.75,52.86 73.66,50.96 JP11.6
TXD
  Top 0.203: IC3.14 20.95,40.01 20,40.96 11.75,40.96 X3.3
VCC  (via drill 0.64)
  Top 0.406: v23.5,31.11 IC3.16
  Top 0.813: JP5.3 36.2,4.45 35.56,4.45 R10.1 33.66,6.99 | v23.02,17.3 29.37,10.95 31.27,8.89 33.42,6.75 | v23.5,31.11 34.92,31.11 37.47,33.66 | 33.42,6.75 33.66,6.51 33.66,6.99 | 37.47,33.66 37.47,36.7 R6.1 R20.2 R12.1 | R19.2 R5.1 R28.2 47.49,35.05 | 47.49,35.05 47.49,34.8 46.35,33.66 37.47,33.66 | R4.1 R27.2 R15.1 57.78,36.7 57.78,34.92 | R29.2 R22.2 R14.1 R26.2 67.81,45.59 69.22,46.99 77.97,46.99 | R29.2 R23.2 67.94,29.21 67.94,25.53 R30.2 67.94,25.4 67.94,21.72 R24.2 67.94,21.59 67.94,17.91 R31.2 67.94,17.78 67.94,14.1 R32.2 | R25.2 78.11,13.97 78.11,17.65 R18.1 R9.1 78.11,21.72 78.11,25.4 R17.1 R8.1 R16.1 R7.1 R21.2 R13.1 77.97,46.99 | 47.49,35.05 48.9,33.66 56.52,33.66 57.78,34.92 | 57.78,34.92 59.05,33.66 67.18,33.66 R29.2 | 33.66,6.99 33.42,6.75 | R33.2 78.11,47.62 78.11,47.31 77.97,46.99
  Bottom 0.813: 21.75,21.11 23.5,22.86 v23.5,31.11
  Bottom 1.016: 21.75,21.11 19.68,19.05 DC1.6 21.27,19.05 v23.02,17.3

### Text on the board
Top: 1
Bottom: 2
tPlace: 5V | 9 | 8 | 7 | 6 | 5 | 4 | 3 | 2 | 1 | 0 | 23 | 14 | 15 | 16 | 17 | 12 | 11 | 10 | 25 | 27 | 29 | 31 | 33 | 35 | 37 | 39 | 41 | 43 | 45 | 47 | 49 | 51 | 53 | 55 | 0 | 1 | 2 | 3 | 4 | 5 | 6 | 7 | 8 | 9 | 10 | 11 | 5V | GND | VIN
tNames: I/O Selectric v1.0 | github.com/ibm2030 | c 2019 L Wilkinson